# EAGLE board KELU1-0232 (EAGLE 9.0.0)
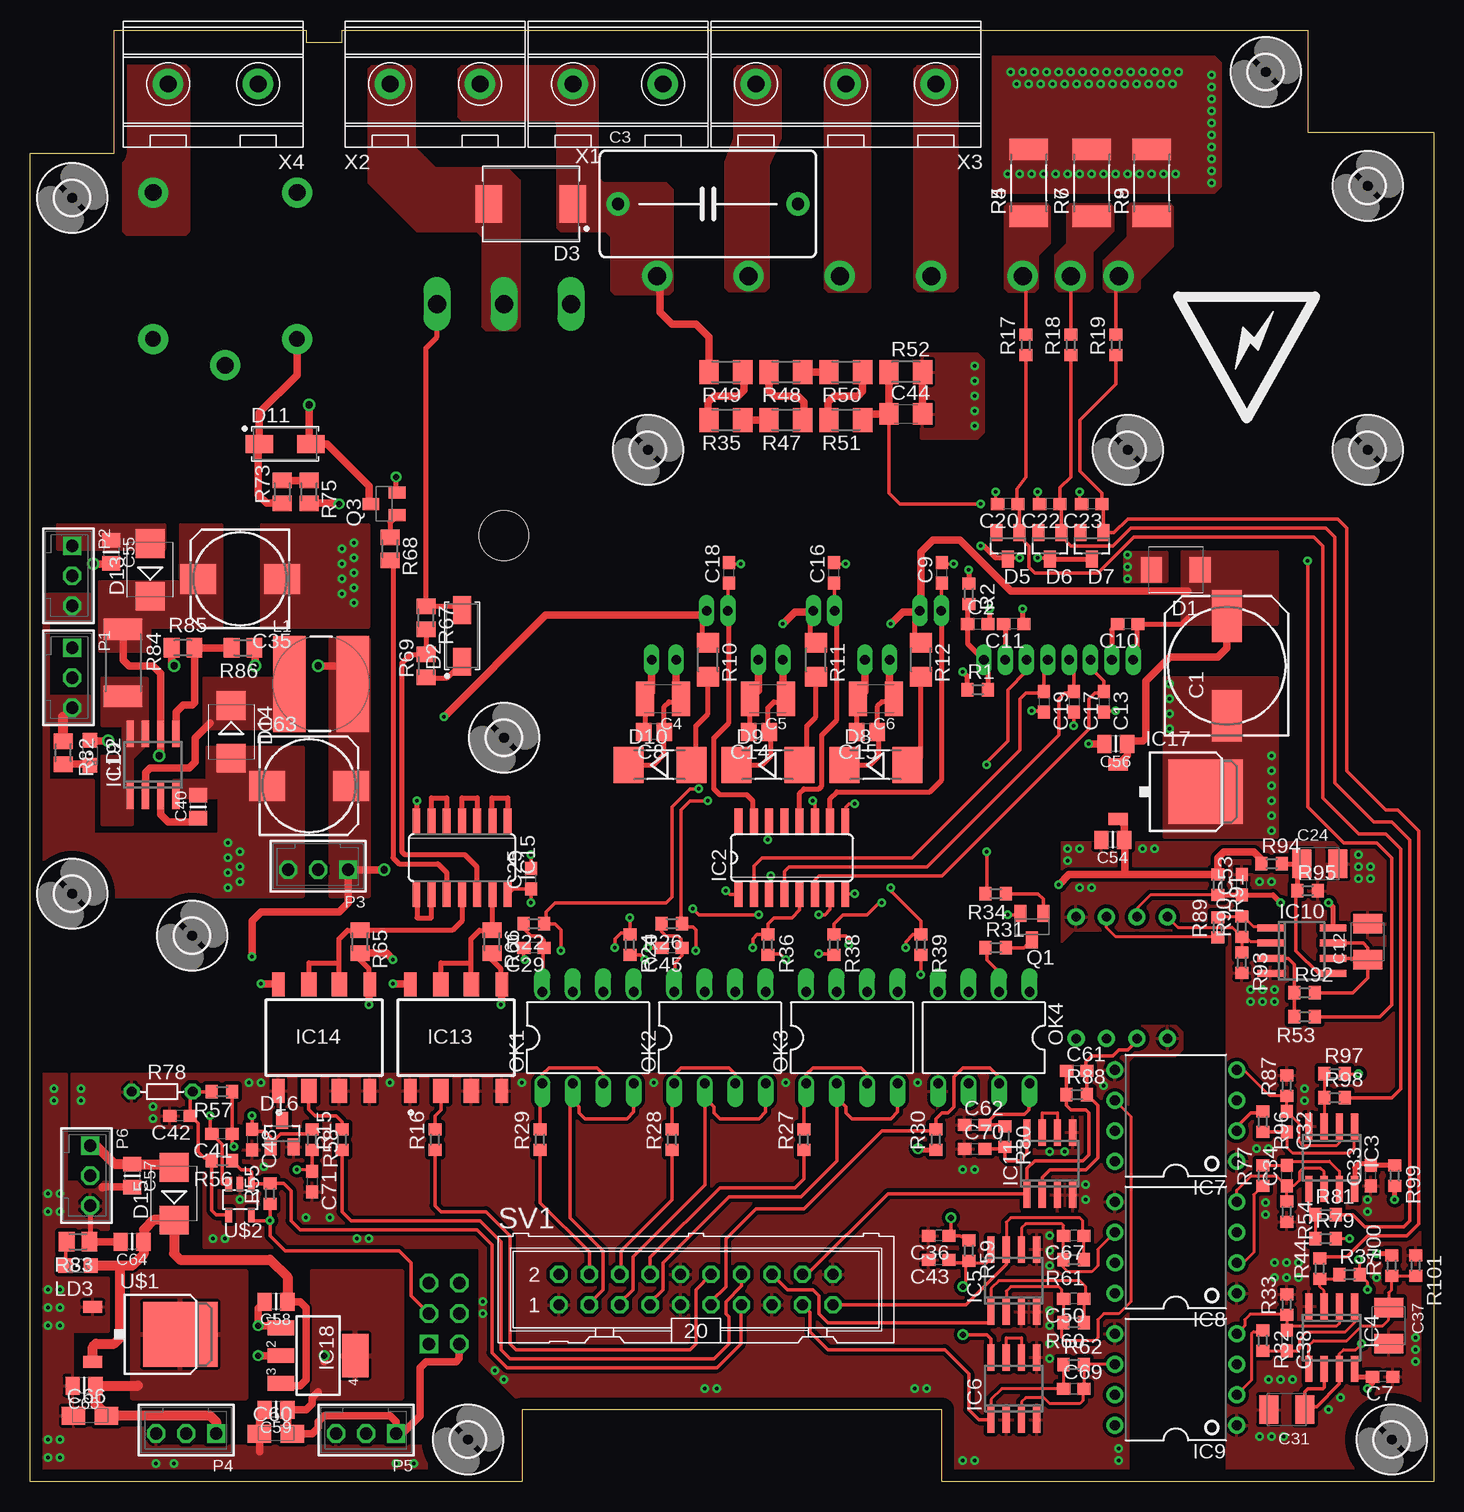
[diagram p7: board, top side]
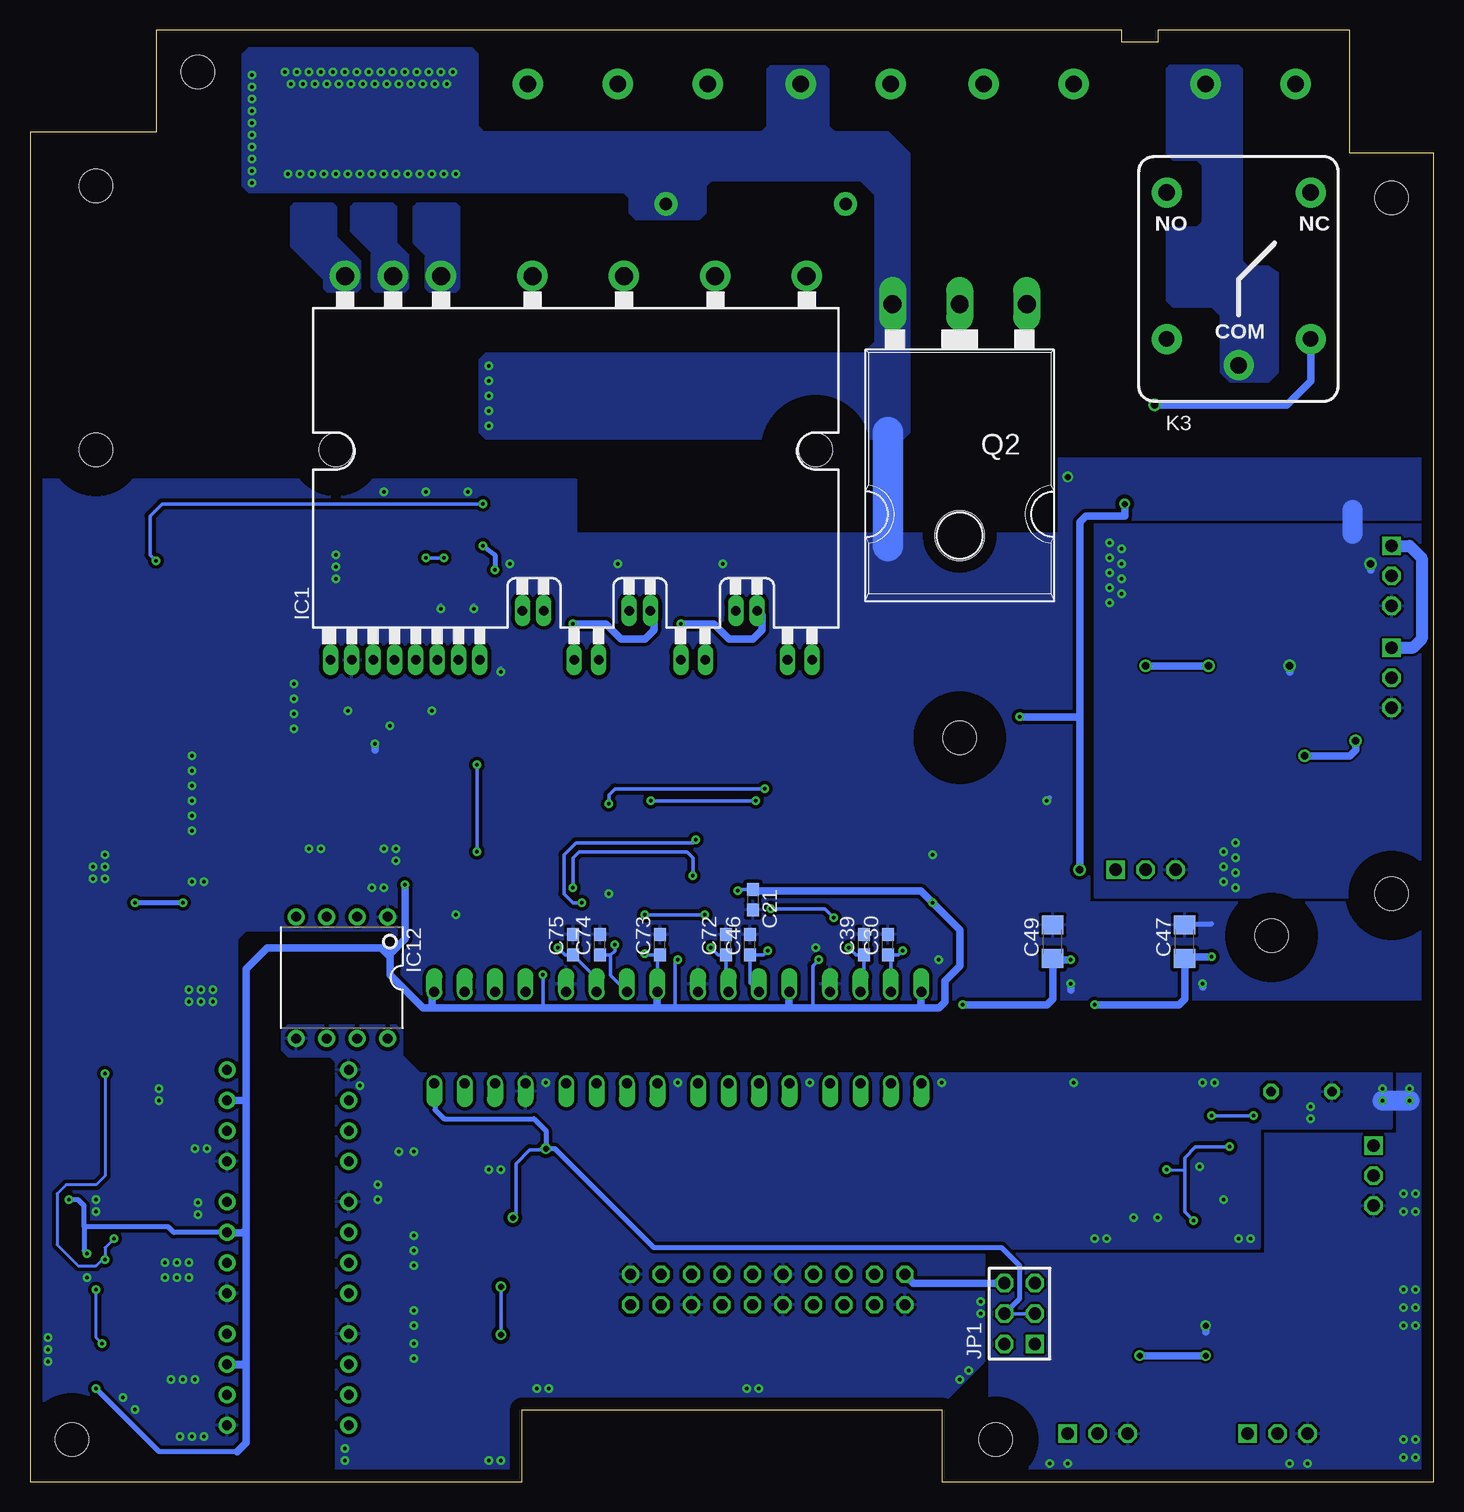
[diagram p8: board, bottom side, seen from below]

Size 117 x 121 mm. Coordinates in mm from the lower left corner, seen from the top.
Outline: 0,0 0,110.75 7,110.75 7,121 23,121 23,120 26,120 26,121 106.5,121 106.5,112.5 117,112.5 117,0 76,0 76,6 41,6 41,0 0,0
Copper layers (1*16): Top 0.035mm / dielectric 1.5mm / Bottom 0.035mm
Design rules "default": minimum track width 10mil, minimum drill 24mil, track to track 8mil, track to pad 8mil, pad to pad 8mil, via to via 8mil, smd to smd 8mil, copper to edge 40mil, drill to drill 8mil, minimum pad ring 10mil, minimum via ring 8mil, stop-mask expansion 4mil, vias tented up to drill 0mil, thermal gap 10mil

## Footprints (pad centres in the part's own frame; a part is rotated, then mirrored left to right if it is on the bottom)
140CLH-1010 = smd 4.3 x 2.5: + 4.15,0; - -4.15,0
C0603 = smd 1.1 x 1: 1 -0.85,0; 2 0.85,0
C150-091X182 = drill 1.016 pad 1.93: 1 -7.493,0; 2 7.493,0
C1210K = smd 1.5 x 2.9: 1 -1.5,0; 2 1.5,0
C0805 = smd 1.3 x 1.5: 1 -0.85,0; 2 0.85,0
SMC_B = smd 1.6 x 2.4: + -1.5,0; - 1.5,0
175TMP-0810 = smd 3 x 2.5: + 3.5,0; - -3.5,0
C0805' = smd 1.2 x 1.5: 1 -0.953,0; 2 0.953,0
C1206 = smd 1.6 x 1.8: 1 -1.4,0; 2 1.4,0
A/3216-18R = smd 1.95 x 1.5: + 1.375,0; - -1.375,0
SMBJ = smd 1.78 x 2.16: A 2.04,0; C -2.03,0
DIOM5326X292N = smd 2.3 x 1.5: A 2.15,0; K -2.15,0
DIOM7959X265N = smd 2.2 x 3.15: A 3.5,0; K -3.5,0
SOT23 = smd 1 x 1.4: 1 -0.95,-1.1; 2 0.95,-1.1; 3 0,1.1
MELF-MLL41 = smd 2.5 x 3: A 2.625,0; C -2.625,0
SMB = smd 2.4 x 2.4: A 2.2,0; C -2.2,0
2,8 = hole 2.8: 0,0
FSBB30CH60 = drill 0.8 pad 1.27 long: 1 -20.447,-16; 2 -18.669,-16; 3 -16.891,-16; 4 -15.113,-16; 5 -13.335,-16; 6 -11.557,-16; 7 -9.779,-16; 8 -8.001,-16; 9 -4.445,-11.9; 10 -2.667,-11.9; 11 -0.136,-16; 12 1.914,-16; 13 4.445,-11.9; 14 6.223,-11.9; 15 8.754,-16; 16 10.804,-16; 17 13.335,-11.9; 18 15.113,-11.9; 19 17.644,-16; 20 19.694,-16 | drill 1.5 pad 2.54: 21 -19.24,16; 22 -15.24,16; 23 -11.24,16; 24 -3.62,16; 25 4,16; 26 11.62,16; 27 19.24,16
SO16 = smd 0.66 x 2.032: 1 -4.445,-3.073; 2 -3.175,-3.073; 3 -1.905,-3.073; 4 -0.635,-3.073; 5 0.635,-3.073; 6 1.905,-3.073; 7 3.175,-3.073; 8 4.445,-3.073; 9 4.445,3.073; 10 3.175,3.073; 11 1.905,3.073; 12 0.635,3.073; 13 -0.635,3.073; 14 -1.905,3.073; 15 -3.175,3.073; 16 -4.445,3.073
SO08 = smd 0.6 x 2.2: 1 -1.905,-2.6; 2 -0.635,-2.6; 3 0.635,-2.6; 4 1.905,-2.6; 5 1.905,2.6; 6 0.635,2.6; 7 -0.635,2.6; 8 -1.905,2.6
DIL08-400 = drill 0.813 pad 1.422: 1 -3.81,-5.08; 2 -1.27,-5.08; 3 1.27,-5.08; 4 3.81,-5.08; 5 3.81,5.08; 6 1.27,5.08; 7 -1.27,5.08; 8 -3.81,5.08
HCPL-3180 = smd 1.016 x 2: 1 -3.81,-4.45; 4 3.81,-4.45; 5 3.81,4.45; 8 -3.81,4.45 | smd 1.27 x 2: 2 -1.27,-4.45; 3 1.27,-4.45; 6 1.27,4.45; 7 -1.27,4.45
SO14 = smd 0.66 x 2.032: 1 -3.81,-3.073; 2 -2.54,-3.073; 3 -1.27,-3.073; 4 0,-3.073; 5 1.27,-3.073; 6 2.54,-3.073; 7 3.81,-3.073; 8 3.81,3.073; 9 2.54,3.073; 10 1.27,3.073; 11 0,3.073; 12 -1.27,3.073; 13 -2.54,3.073; 14 -3.81,3.073
D-PAK_TO252AA = smd 1 x 1.6: 1 -2.28,-4.8; 3 2.28,-4.8 | smd 5.4 x 6.2: 4 0,2.5
SOT223 = smd 1.219 x 2.235: 1 -2.311,-3.099; 2 0,-3.099; 3 2.311,-3.099 | smd 3.6 x 2.2: 4 0,3.099
SOIC8 = smd 0.6 x 2.2: 1 -1.905,-2.6; 2 -0.635,-2.6; 3 0.635,-2.6; 4 1.905,-2.6; 5 1.905,2.6; 6 0.635,2.6; 7 -0.635,2.6; 8 -1.905,2.6
JACK = drill 0.89: P1 4.44,8.89; P2 3.17,6.35; P3 1.905,8.89; P4 0.635,6.35; P5 -0.635,8.89; P6 -1.905,6.35; P7 -3.17,8.89; P8 -4.44,6.35 | drill 1.02: P9 5.46,13.72; P10 2.92,13.72; P11 -2.92,13.72; P12 -5.46,13.72 | drill 1.63: S1 -7.87,3.05; S2 7.87,3.05 | hole 3.18: -5.715,0; 5.715,0
2X03 = drill 1.016 square: 1 -2.54,-1.27 | drill 1.016 octagon: 2 -2.54,1.27; 3 0,-1.27; 4 0,1.27; 5 2.54,-1.27; 6 2.54,1.27
HJR21FF = drill 1.3 pad 2.5: COIL_1 -6,-4; COIL_2 6,-4 | drill 1.4 pad 2.5: COM 0,-6.2; NC 6,8.2; NO -6,8.2
SDR0805 = smd 2.7 x 8: 1 -2.65,0; 2 2.65,0
CHIPLED_0805 = smd 1.2 x 1.2: A 0,-1.05; C 0,1.05
DIL08 = drill 0.813 offset: 1 -3.81,-3.81; 2 -1.27,-3.81; 3 1.27,-3.81; 4 3.81,-3.81; 5 3.81,3.81; 6 1.27,3.81; 7 -1.27,3.81; 8 -3.81,3.81
B3B-EH-A = drill 1.016 square: 1 -2.5,0 | drill 1.016 octagon: 2 0,0; 3 2.5,0
SOT23-BEC = smd 1 x 1.4: B -0.95,-1.1; C 0,1.1; E 0.95,-1.1
TO247BH = drill 1.499 long: D 0,-10.16; G -5.588,-10.16; S 5.588,-10.16 | hole 4.115: 0,9.144
R0603 = smd 1 x 1.1: 1 -0.85,0; 2 0.85,0
R2512 = smd 1.8 x 3.2: 1 -2.8,0; 2 2.8,0
R1206 = smd 1.6 x 1.803: 1 -1.422,0; 2 1.422,0
M1206 = smd 1.6 x 2: 1 -1.4,0; 2 1.4,0
M0805 = smd 1.3 x 1.6: 1 -0.95,0; 2 0.95,0
R-5 = drill 0.813 octagon: 1 -2.54,0; 2 2.54,0
ML20 = drill 0.914 octagon: 1 -11.43,-1.27; 2 -11.43,1.27; 3 -8.89,-1.27; 4 -8.89,1.27; 5 -6.35,-1.27; 6 -6.35,1.27; 7 -3.81,-1.27; 8 -3.81,1.27; 9 -1.27,-1.27; 10 -1.27,1.27; 11 1.27,-1.27; 12 1.27,1.27; 13 3.81,-1.27; 14 3.81,1.27; 15 6.35,-1.27; 16 6.35,1.27; 17 8.89,-1.27; 18 8.89,1.27; 19 11.43,-1.27; 20 11.43,1.27
SOT23-5 = smd 0.55 x 1.2: 1 -0.95,-1.3; 2 0,-1.3; 3 0.95,-1.3; 4 0.95,1.3; 5 -0.95,1.3
DG129-7.5-02P-14-00A = drill 1.4 pad 2.54: 1 -3.75,0; 2 3.75,0
DG129-7.5-03P-14-00A = drill 1.4 pad 2.54: 1 -7.5,0; 2 0,0; 3 7.5,0

## Placement (x,y rotation side)
C1  220uF 25v  [140CLH-1010]  99.75,68 90 top
C2  [C0603]  79,71.5 0 top
C3  [C150-091X182]  56.5,106.5 0 top
C4  10uF 50v  [C1210K]  52.75,65.25 180 top
C5  10uF 50v  [C1210K]  61.5,65.25 180 top
C6  10uF 50v  [C1210K]  70.5,65.25 180 top
C7  [C0603]  112.75,8.75 180 top
C8  0.1uF  [C0805]  52,62.5 180 top
C9  [C0603]  76,75.75 90 top
C10  [C0603]  91.5,71.5 180 top
C11  [C0603]  82,71.5 180 top
C12  [SMC_B]  111.5,45 90 top
C13  [C0603]  89.5,65 270 top
C14  0.1uF  [C0805]  60.75,62.5 180 top
C15  0.1uF  [C0805]  69.75,62.5 180 top
C16  [C0603]  67,75.75 90 top
C17  [C0603]  87,65 270 top
C18  [C0603]  58.25,75.75 90 top
C19  [C0603]  84.5,65 270 top
C20  [C0603]  81.5,81.5 180 top
C21  [C0603]  56.75,48.5 270 bottom
C22  [C0603]  85,81.5 180 top
C23  [C0603]  88.5,81.5 180 top
C24  [SMC_B]  107.5,51.5 0 top
C25  [C0603]  41.75,50.25 90 top
C29  [C0603]  42,44.5 180 top
C30  [C0603]  45.5,44.75 90 bottom
C31  [SMC_B]  104.75,6 180 top
C32  [C0603]  104.75,30 270 top
C33  [C0603]  111.75,25.5 90 top
C34  [C0603]  104.75,25.5 90 top
C35  100u  [175TMP-0810]  17.5,75.25 180 top
C36  [C0603]  75.75,20.5 180 top
C37  [SMC_B]  113.25,13 270 top
C38  [C0603]  104.75,11.75 270 top
C39  [C0603]  47.5,44.75 90 bottom
C40  720p  [C0805']  14,56.25 90 top
C41  [C0603]  16,29 180 top
C42  [C0603]  12.5,30.5 180 top
C43  [C0603]  75.75,18.5 180 top
C44  [C1206]  73,89 0 top
C45  [C0603]  53.5,44.5 180 top
C46  [C0603]  57,44.75 90 bottom
C47  0.1uF  [C1206]  20.75,45 90 bottom
C48  [C0603]  18.5,28.5 270 top
C49  0.1uF  [C1206]  31.75,45 90 bottom
C50  [C0603]  87,15.25 180 top
C53  [C0603]  101,49.75 90 top
C54  [C0805']  90.25,53.5 180 top
C55  [C0805']  6.75,77.5 270 top
C56  [C0805']  90.5,61.5 180 top
C57  [C0805']  8.5,25.5 270 top
C58  [C0805']  20.5,15 180 top
C59  [C0805']  20.5,6 180 top
C60  [A/3216-18R]  20.5,4 0 top
C61  [C0603]  87.25,34.25 0 top
C62  [C0603]  78.75,29.75 0 top
C63  [175TMP-0810]  23.25,58 0 top
C64  [C0805']  8.5,20 180 top
C65  [C0805']  4.5,8 180 top
C66  [A/3216-18R]  5,5.5 0 top
C67  [C0603]  87,20.5 180 top
C69  [C0603]  87,7.75 0 top
C70  [C0603]  78.75,27.75 0 top
C71  [C0603]  23.5,25 270 top
C72  [C0603]  59,44.75 90 bottom
C73  [C0603]  64.5,44.75 90 bottom
C74  [C0603]  69.5,44.75 90 bottom
C75  [C0603]  71.75,44.75 90 bottom
D1  [SMBJ]  95.5,76 180 top
D2  RS1J  [DIOM5326X292N]  36,70.5 90 top
D3  GS3J  [DIOM7959X265N]  41.75,106.5 180 top
D5  BAS70  [SOT23]  81.5,78 180 top
D6  BAS70  [SOT23]  85,78 180 top
D7  BAS70  [SOT23]  88.5,78 180 top
D8  [MELF-MLL41]  70.5,59.75 0 top
D9  [MELF-MLL41]  61.5,59.75 0 top
D10  [MELF-MLL41]  52.5,59.75 0 top
D11  [DIOM5326X292N]  21.25,86.5 0 top
D13  [SMB]  10,76 90 top
D14  STPS340U  [SMB]  16.75,62.5 270 top
D15  [SMB]  12,24 90 top
D16  LM4041-N  [SOT23]  21,29 0 top
H1  MOUNT-HOLE2.8  [2,8]  91.5,86 0 top
H2  MOUNT-HOLE2.8  [2,8]  51.5,86 0 top
H3  MOUNT-HOLE2.8  [2,8]  3.5,49 0 top
H4  MOUNT-HOLE2.8  [2,8]  113.5,3.5 0 top
H5  MOUNT-HOLE2.8  [2,8]  111.5,108 0 top
H6  MOUNT-HOLE2.8  [2,8]  3.5,107 0 top
H7  MOUNT-HOLE2.8  [2,8]  103,117.5 0 top
H8  MOUNT-HOLE2.8  [2,8]  111.5,86 0 top
H9  MOUNT-HOLE2.8  [2,8]  36.5,3.5 0 top
H10  MOUNT-HOLE2.8  [2,8]  13.5,45.5 0 top
H11  MOUNT-HOLE2.8  [2,8]  39.5,62 0 top
IC1  FSBB30CH60  [FSBB30CH60]  71.5,84.5 0 bottom
IC2  4049D  [SO16]  63.5,52 0 top
IC3  LM358D  [SO08]  108.5,27 180 top
IC4  LM358D  [SO08]  108.5,12 180 top
IC5  LM358D  [SO08]  82,16.75 0 top
IC6  LM358D  [SO08]  82,7.75 0 top
IC7  IL3000  [DIL08-400]  95.5,30.5 90 top
IC8  IL3000  [DIL08-400]  95.5,19.5 90 top
IC9  IL3000  [DIL08-400]  95.5,8.5 90 top
IC10  LM358D  [SO08]  106,44.25 270 top
IC11  LM358D  [SO08]  85,26.5 0 top
IC12  IL3000  [DIL08-400]  91,42 180 bottom
IC13  HCPL-3180-300E  [HCPL-3180]  35.5,37 0 top
IC14  HCPL-3180-300E  [HCPL-3180]  24.5,37 0 top
IC15  74AC14D  [SO14]  36,52 180 top
IC17  L78MXXAB  [D-PAK_TO252AA]  95.5,57.5 270 top
IC18  [SOT223]  24,10.5 270 top
IC19  MC34063AD  [SOIC8]  10.25,59.75 0 top
J1  0480251190  [JACK]  4,-36 0 top  (outside the outline)
JP1  [2X03]  34.5,14 90 bottom
K3  HJR-21FF  [HJR21FF]  16.25,99.25 0 bottom
L1  SDR0805  [SDR0805]  24.25,66.5 0 top
LD2  [CHIPLED_0805]  5,60.75 180 top
LD3  [CHIPLED_0805]  4,18 90 top
OK1  HCPL2530  [DIL08]  46.5,37 0 top
OK2  HCPL2530  [DIL08]  57.5,37 0 top
OK3  HCPL2530  [DIL08]  68.5,37 0 top
OK4  HCPL2530  [DIL08]  79.5,37 180 top
P1  B3B-EH-A  [B3B-EH-A]  3.5,67 270 top
P2  B3B-EH-A  [B3B-EH-A]  3.5,75.5 270 top
P3  B3B-EH-A  [B3B-EH-A]  24,51 180 top
P4  B3B-EH-A  [B3B-EH-A]  13,4 180 top
P5  B3B-EH-A  [B3B-EH-A]  28,4 180 top
P6  B3B-EH-A  [B3B-EH-A]  5,25.5 270 top
Q1  BC817-16LT1SMD  [SOT23-BEC]  83.5,46.25 180 top
Q2  IRFP240-H  [TO247BH]  39.5,88 180 bottom
Q3  BC817-40SMD  [SOT23-BEC]  29.5,81.5 90 top
R1  [R0603]  79,66 0 top
R2  [R0603]  78.25,74 270 top
R4  0.1R  [R2512]  83.25,108.25 90 top
R5  0.1R  [R2512]  83.25,108.25 90 top
R6  0.1R  [R2512]  88.5,108.25 90 top
R7  0.1R  [R2512]  88.5,108.25 90 top
R8  0.1R  [R2512]  93.5,108.25 90 top
R9  0.1R  [R2512]  93.5,108.25 90 top
R10  [R1206]  56.5,68.5 270 top
R11  [R1206]  65.5,68.5 270 top
R12  [R1206]  74.25,68.5 270 top
R15  [R0603]  26,28.5 90 top
R16  [R0603]  33.75,28.5 90 top
R17  [R0603]  83,94.75 90 top
R18  [R0603]  86.75,94.75 90 top
R19  [R0603]  90.5,94.75 90 top
R22  [R0603]  42,46.5 180 top
R24  [R0603]  50,44.75 270 top
R26  [R0603]  53.5,46.5 180 top
R27  [R0603]  64.5,28.5 90 top
R28  [R0603]  53.5,28.5 90 top
R29  [R0603]  42.5,28.5 90 top
R30  [R0603]  75.5,28.5 90 top
R31  [R0603]  80.5,44.5 0 top
R32  [R0603]  102.75,11.75 270 top
R33  [R0603]  104.75,14.75 90 top
R34  [R0603]  80.5,49 180 top
R35  1M  [M1206]  58,88.5 180 top
R36  [R0603]  61.5,44.75 270 top
R37  [R0603]  110,17.25 0 top
R38  [R0603]  67,44.75 270 top
R39  [R0603]  74.25,44.75 270 top
R44  [R0603]  107.5,17.75 90 top
R47  1M  [M1206]  63,88.5 180 top
R48  1M  [M1206]  63,92.5 180 top
R49  1M  [M1206]  58,92.5 180 top
R50  1M  [M1206]  68,92.5 180 top
R51  1M  [M1206]  68,88.5 180 top
R52  3k  [M1206]  73,92.5 0 top
R53  [R0603]  106.25,38.75 180 top
R54  [R0603]  104.75,22.5 270 top
R55  [R0603]  20,24 90 top
R56  [R0603]  16,26.75 180 top
R57  [R0603]  16,32.5 180 top
R58  [R0603]  23.5,28.5 270 top
R59  [R0603]  78.25,19.25 270 top
R60  [R0603]  87,13.25 180 top
R61  [R0603]  87,18.5 180 top
R62  [R0603]  87,9.75 0 top
R65  1k  [M0805]  27.5,45 270 top
R66  1k  [M0805]  38.5,45 270 top
R67  [M0805]  33,72 270 top
R68  [M0805]  30,77.75 270 top
R69  [M0805]  33,68 90 top
R73  [M0805]  21,82.5 90 top
R75  [M0805]  23.25,82.5 270 top
R77  [R0603]  102.75,25.5 90 top
R78  THERMISTOR-5  [R-5]  11,32.5 0 top
R79  [R0603]  108,20.25 0 top
R80  [R0603]  81.25,28.75 270 top
R81  [R0603]  108,22.25 0 top
R82  [M0805]  2.75,60.75 270 top
R83  [M0805]  4,20 180 top
R84  0.2  [R2512]  7.75,68.25 270 top
R85  1.2k  [M0805]  12.75,69.5 0 top
R86  13.2k  [M0805]  17.75,69.5 180 top
R87  [R0603]  104.75,33 90 top
R88  [R0603]  87.25,32.25 0 top
R89  [R0603]  99,46.19 90 top
R90  [R0603]  101,46.25 90 top
R91  [R0603]  99,49.75 270 top
R92  [R0603]  106.25,40.75 0 top
R93  [R0603]  101,43.25 270 top
R94  [R0603]  103.5,51.5 0 top
R95  [R0603]  106.5,49.25 0 top
R96  [R0603]  102.75,30 270 top
R97  [R0603]  108.75,34 0 top
R98  [R0603]  108.75,32 0 top
R99  [R0603]  113.75,25.5 270 top
R100  [R0603]  113.5,18 90 top
R101  [R0603]  115.5,18 270 top
SV1  [ML20]  55.5,16 0 top
U$1  MC33269DPAK  [D-PAK_TO252AA]  10.02,12.27 270 top
U$2  TS391  [SOT23-5]  17.5,23.5 180 top
U$3  [ICON_BOLT-L]  101.41,94.33 180 top
X1  DG129-7.5-02P  [DG129-7.5-02P-14-00A]  49,116.5 180 top
X2  DG129-7.5-02P  [DG129-7.5-02P-14-00A]  33.75,116.5 180 top
X3  DG129-7.5-03P  [DG129-7.5-03P-14-00A]  68,116.5 180 top
X4  DG129-7.5-02P  [DG129-7.5-02P-14-00A]  15.25,116.5 180 top

## Tracks (layer width: path | path; a pad name or v marks a point on that pad's centre or on a via)
1V65  (via drill 0.3)
  Top 0.254: IC4.7 109.14,10.63 109.5,11 110.5,11 v111,11.5 | v111.5,16 111.5,16.6 R37.2 110.85,18.4 v110.75,18.5 | v110,20.25 R79.2 | R97.2 v110.75,34
  Top 0.305: IC4.7 109.14,8.13 107.25,6.25 106.5,6.25 C31.+ 106.25,7.5 106.5,7.75 107.75,7.75 107.86,7.87 IC4.6
  Bottom 0.254: v110.75,34 110.75,25.5 111.5,24.75 114,24.75 114.75,24 114.75,19.75 113,18 111.5,18 111,18.5 v110.75,18.5 110.75,19.5 v110,20.25 | v111,11.5 111.5,12 v111.5,16
3.3V  (via drill 0.5)
  Top 0.254: R59.2 78.4,18.25 79.75,18.25 80,18.5 80,19.25 IC5.8 | v77.75,16.25 78,16.5 78,18.15 78.1,18.25
  Top 0.305: R59.2 78.1,18.25 76.6,18.25 C43.1 | IC6.8 80.09,11.9 79.75,12.25 v77.75,12.25
  Bottom 0.305: v77.75,12.25 v77.75,16.25
5VA
  Top 0.406: R99.1 C33.2 111.85,26.5 110.75,26.5 110.41,26.16 IC3.8
+3V3D  (via drill 0.5)
  Top 0.61: IC18.2 v19,10.5 | v24.5,10.5 24.5,10 | 24,7.5 23.5,7 23.5,6.5 23,6 C59.1 21.45,4.42 C60.+ 23.5,4 24,4.5 24,5 24.5,5.5 30,5.5 30.5,5 P5.1 31,4 32.5,5.5 32.5,9.5 33,10 35.5,10 35.77,10.27 JP1.2
  Bottom 0.61: v19,10.5 v24.5,10.5
  pour Top: 23.5,17.5 23.5,7 31,7 31,17.5
+5V
  Top 0.813: 9,8 C65.1 5.45,6.42 C66.+ 15,5.5 15.5,5 P4.1
  pour Top: 8.5,17.5 8.5,7 18,7 18,17.5
+5VA  (via drill 0.3)
  Top 0.152: OK1.8 42.69,41.31 42.75,41.37
  Top 0.305: 110.5,8.75 110.41,8.75 IC4.8 | R24.2 50.85,43.9 v51.25,43.5 | 42.75,41.37 42.75,44.4 C29.1 42.85,45.15 42.5,45.5 41.75,45.5 41.15,46.1 R22.2 | v41.75,48.25 C25.1 40.28,49.4 IC15.14 | v58,49.25 58.32,48.93 IC2.1 | R26.2 52.65,45.85 53,45.5 54,45.5 54.25,45.25 54.25,44.6 C45.1 54.35,43.85 53.75,43.25 53.75,40.87 OK2.8 | R36.2 61.6,44 62.5,44 v63,43.5 | R38.2 66.9,44 v65.75,44 | R39.2 74,43.65 74.25,43.65 v74.25,42.25
  Top 0.406: R100.2 113.35,19 v112.25,19 | IC4.8 110.5,9.3 110.5,8.75 C7.2 | C7.2 112,8.75 | v111.5,7.75 111.9,8.15 C7.2 | v113.75,23.5 R99.2
  Top 0.61: IC17.3 91.2,54.72 C54.1 91.25,53.45 91.25,50.6 | 91.25,50.6 86.6,50.6 v85.75,49.75 | 91.25,50.6 R91.1 99,52 99.5,52.5 102,52.5 102.65,51.85 R94.1
  Bottom 0.152: IC8.3 100.08,20.77 100.06,20.75 | OK1.8 42.75,40.81
  Bottom 0.305: v51.25,43.5 51.75,43 51.75,39.5 | C21.1 57.9,49.35 v58,49.25 | OK3.8 64.69,43.46 C73.1 65.65,43.9 v65.75,44 | v63,43.5 63.25,43.25 63.25,39.5 | v74.25,42.25 74.25,39.5
  Bottom 0.406: 112.5,21.25 105.5,21.25 105.02,20.77 IC8.3 | 99.75,2.5 106.25,2.5 v111.5,7.75 | OK1.8 42.75,40.87 | 112.5,21.25 112.5,23 113,23.5 v113.75,23.5 | 112.5,21.25 112.5,19.25 v112.25,19
  Bottom 0.61: 99,9.75 99.27,9.77 IC9.3 100.56,9.75 99,9.75 | 99,9.75 99,3.25 99.75,2.5 | 99,9.75 99,20.75 | 99,20.75 99.27,20.77 | 100.06,20.75 99,20.75 | 99,20.75 99,31.75 | 99,31.75 99.27,31.77 IC7.3 | 87.12,43.88 87,43.75 87,42.25 84.25,39.5 83.5,39.5 | 87.12,43.88 87.75,44.5 97.25,44.5 99,42.75 99,31.75 | v85.75,49.75 85.75,45.25 87.12,43.88 | OK3.8 64.75,40.81 64.75,39.5 | 64.75,39.5 74.25,39.5 83.5,39.5 | OK4.1 83.5,40.81 83.5,39.5 | OK2.8 53.75,40.81 53.75,39.5 | 53.75,39.5 63.25,39.5 64.75,39.5 | 42.75,40.81 42.75,39.5 | 42.75,39.5 51.75,39.5 53.75,39.5 | 42.75,39.5 41.25,39.5 40.75,40 40.75,41.75 39.5,43 39.5,46 v41.75,48.25 42.75,49.25 56.65,49.25 C21.1
+9V
  Top 0.813: P6.1 5.5,28 7,26.5 8.45,26.5 C57.1 11.75,26.45 D15.A
+15V  (via drill 0.3, 0.5, 0.6)
  Top 0.406: IC1.14 65,72.32 65,70.25 65.33,69.92 R11.1 | IC1.18 56,72.21 56,70.25 56.33,69.92 R10.1 | R12.1 73.75,69.92 73.75,72.18 IC1.10 | IC1.1 92.25,68.8 92.25,71.4 C10.1 96,71.5 96.5,72 | IC13.5 39.25,41.51 39.25,42.75 38.5,43.5 R66.2 | IC14.5 28.25,41.51 28.25,42.75 27.5,43.5 R65.2
  Top 0.61: R86.1 18.75,69.45 v18.75,68 | v24,68 26.75,68 | v29.5,51 P3.1 26.5,48.25 25.75,47.5 19.25,47.5 18.5,46.75 v18.5,43.75 | v25.75,81.5 25.7,81.55 R75.2 | 74,72.5 74.07,72.5 IC1.10 | 74,72.5 72.75,72.5 v71.75,71.5 | v62.75,71.5 63.75,72.5 65.25,72.5 65.25,72.57 IC1.14 | R12.1 74,70.17 | 74,72.5 74.25,72.75 74.25,77.5 75.25,78.5 77.5,78.5 81.75,74.25 96.5,74.25 | IC17.1 91.45,60.53 C56.1 91.7,61.75 92.75,61.75 93,62 93,66.75 95,68.75 99,68.75 99.75,69.5 C1.+ | 56,72.21 42.96,72.21 v34.5,63.75 | v28.25,39.75 28.25,41.39 IC14.5 | v30.25,43.5 29.7,44.05 R65.2 | v39.25,39.75 39.31,39.81 IC13.5
  Bottom 0.61: v18.75,68 v24,68 | v29.5,51 29.5,63.75 | 29.5,63.75 29.5,80 29,80.5 25.75,80.5 v25.75,81.5 | 65,72.32 65,71 65.75,70.25 67.75,70.25 69,71.5 v71.75,71.5 | 65,72.32 IC1.14 | v62.75,71.5 60,71.5 58.75,70.25 56.75,70.25 56,71 56,72.21 IC1.18 | 65,72.32 65,72.5 | v34.5,63.75 29.5,63.75 | v28.25,39.75 21.25,39.75 20.75,40.25 C47.1 20.6,43.75 v18.5,43.75 | v30.25,43.5 31.65,43.5 C49.1 31.75,40.25 32.25,39.75 v39.25,39.75
  pour Top (no thermals): 25,70.25 28.25,70.25 28.25,48.75 25,48.75
  pour Top (no thermals): 96,77.5 96,71.5 104,71.5 104,77.5
+24V
  Bottom 1.016: P2.1 2,78 1,77 1,70.25 1.75,69.5 P1.1
  pour Top (no thermals): 2.25,79.75 2.25,77.75 11.25,77.75 11.25,79.75
AGND  (via drill 0.3, 0.5, 0.6)
  Top 0.254: C22.2 84,81.65 v84,82.5 | C23.2 87.5,81.65 v87.5,82.5 | C20.2 80.5,81.65 v80.5,82.5
  Top 0.305: C9.2 76.1,76.5 v77,76.5 | C16.2 67.35,76.5 v68,76.5 | C18.2 58.6,76.5 v59.25,76.5 | C13.2 89.6,64.25 v90.5,64.25 | C17.2 v87,63 | C19.2 84.4,64.25 v83.5,64.25 | Q1.E 82.45,47.25 v81.5,47.25 | C44.2 74.5,88.9 | C29.2 41.15,43.6 v41.25,43.5 | C25.2 v41.75,52.25 | C45.2 v51.5,44.5 | IC2.8 68.02,49 v68.75,49
  Top 0.406: Q3.E 30.5,82.55 v30.5,83.75 | C2.2 80,71.65 v80,72.75 | C11.1 82.75,71.6 v82.75,72.75 | R1.1 78.15,67.1 v77.75,67.5 | C10.2 90.17,71.02 IC1.2 | IC15.7 32.25,55.13 v32.25,56.75
  Top 0.61: C55.2 6.7,76.5 v5.25,76.5 | R85.1 11.8,68.2 v12,68 | C56.2 v88.25,61.5 | IC13.8 31.64,41.5 v30.25,41.5 | IC14.8 20.64,41.5 v19.25,41.5 | C44.2 R52.2 | 74.5,88.9 74.6,89
  Top 0.813: R82.1 2.75,63.75
  Bottom 0.254: v84,82.5 83.75,82.5 | v87.5,82.5 87.25,82.5 | v80.5,82.5 80.25,82.5
  Bottom 0.305: v77,76.5 77,76.75 | v68,76.5 68,76.75 | v59.25,76.5 59.25,76.75 | v90.5,64.25 90.5,64.5 | v87,63 86.75,63 | v83.5,64.25 83.5,64 | v81.5,47.25 81.5,47 | v41.25,43.5 41.5,43.5 | v41.75,52.25 41.5,52.25 | v68.75,49 68.75,49.25
  Bottom 0.406: v30.5,83.75 30.25,83.75 | v80,72.75 80,73 | v82.75,72.75 82.75,73 | v77.75,67.5 77.75,67.75 | v32.25,56.75 32,57 | C47.2 20.65,46.5 18.5,46.5
  Bottom 0.61: v5.25,76.5 5.25,76 | v12,68 12,67.5 | v88.25,61.5 88.25,61 | v30.25,41.5 30.25,41 | v19.25,41.5 19.25,41.25
  Bottom 1.676: 6.75,79 6.75,81
  Bottom 2.54: 45.5,87.5 45.5,78
  other vias: 81.75,117.5 82.75,117.5 83.75,117.5 84.75,117.5 85.75,117.5 86.75,117.5 87.75,117.5 88.75,117.5 89.75,117.5 90.75,117.5 91.75,117.5 92.75,117.5 93.75,117.5 94.75,117.5 95.75,117.5 82.25,116.5 83.25,116.5 84.25,116.5 85.25,116.5 86.25,116.5 87.25,116.5 88.25,116.5 89.25,116.5 90.25,116.5 91.25,116.5 92.25,116.5 93.25,116.5 94.25,116.5 95.25,116.5 81.5,109 82.5,109 83.5,109 84.5,109 85.5,109 86.5,109 87.5,109 88.5,109 89.5,109 90.5,109 91.5,109 92.5,109 93.5,109 94.5,109 95.5,109 27,77 27,75.75 27,74.5 27,73.25 27,78.25 26,77.75 26,76.5 26,75.25 26,74 16.5,49.5 16.5,50.75 16.5,52 16.5,53.25 17.5,50 17.5,51.25 17.5,52.5 98.5,115.25 98.5,114.25 98.5,113.25 98.5,112.25 98.5,111.25 98.5,110.25 98.5,109.25 98.5,108.25 91.5,77.25 91.5,76.25 91.5,75.25 103.5,60.5 103.5,54.25 103.5,55.5 103.5,56.75 103.5,58 103.5,59.25 95,66.5 95,65.25 95,64 95,62.75 78.75,93 78.75,88 78.75,91.75 78.75,89.25 78.75,90.5 105.75,17 104.75,17 103.75,17 105.25,8.5 104.25,8.5 103.25,8.5 115.5,10 115.5,11 115.5,12 103,22.25 103,23.25 102.5,3.75 103.5,3.75 104.5,3.75 108.25,6 109.25,7 111.5,22.5 111.5,23.5 112.25,17 103.75,18.25 104.75,18.25 105.75,18.25 102.25,27.75 103.25,27.75 106.25,31.75 106.25,32.75 102.5,50 103.5,50 110.75,52.25 110.75,51.25 110.75,50.25 111.75,50.25 111.75,51.25 103.75,41 102.75,41 101.75,41 101.75,40 102.75,40 103.75,40 86.5,52.75 87.5,52.75 86.5,51.75 92.75,52.75 93.75,52.75 87.5,49.5 88.5,49.5 98.5,116.25 98.5,117.25
  pour Top (no thermals): 80.25,118.75 80.25,107.5 98.75,107.5 99.25,108 99.25,118.25 98.75,118.75
  pour Bottom: 0.5,79.75 28.25,79.75 28.25,48.75 0.5,48.75
  pour Top (no thermals): 19.25,79.75 19.25,71.25 28.25,71.25 28.25,79.75
  pour Top (no thermals): 14.75,61.25 22.75,61.25 22.75,48.75 0.5,48.75 0.5,74 5,74 5,71.75 1.5,71.75 1.5,65.5 5,65.5 5,63.25 1.5,63.25 1.5,58.5 5.25,58.5 5.25,54 15.75,54 15.75,57 12,57 12,58.5 14.75,58.5
  pour Bottom (isolate 0.305): 84.25,40.25 0.5,40.25 0.5,48.25 28.75,48.25 28.75,80.25 0.5,80.25 0.5,85.25 31.25,85.25 31.25,79 71.5,79 71.5,83.5 117.75,83.5 118,83.25 118,0.5 100,0.5 99.75,0.75 99.75,45.25 99,46 87,46 86,45 86,42
  pour Bottom (no thermals): 50.75,118 50.5,117.75 50.5,113 50,112.5 45.5,112.5 43.75,110.75 43.75,96 44,95.75 46.25,95.75 46.5,96 46.5,107.25 47.75,108.5 60.25,108.5 60.75,108 60.75,105.75 61.25,105.25 66.5,105.25 67,105.75 67,107 67.5,107.5 98.75,107.5 99.25,108 99.25,119 98.75,119.5 80.25,119.5 79.75,119 79.75,113 79.25,112.5 56,112.5 55.5,113 55.5,117.75 55.25,118
  pour Top (no thermals): 94.75,75 91.25,75 91.25,77.5 94.75,77.5
  pour Top (no thermals): 94.75,75 91.25,75 91.25,77.5 94.75,77.5
  pour Top (no thermals): 94.5,67 94.5,53.75 104,53.75 104,67
  pour Bottom (isolate 1.016): 44.25,87 43.75,87.5 43.75,96 46.5,96 46.5,95 47.5,94 79,94 79.5,93.5 79.5,87.5 79,87
  pour Top: 79.5,93.5 79,94 74.25,94 74.25,87 79,87 79.5,87.5
  pour Top (isolate 0.305): 99.75,45.25 99.75,0.75 100,0.5 116.5,0.5 116.5,53.25 86,53.25 86,45 87,46 99,46
BR_CON
  Top 0.305: R16.1 33.75,23 34.25,22.5 38,22.5 40,20.5 40,11.5 40.5,11 55,11 55.5,11.5 55.5,16 SV1.12
DGND  (via drill 0.3, 0.5)
  Top 0.406: P6.3 5,20.05 arc-90 R83.1
  Top 0.61: C58.2 19,14.45 v19,13 20.71,13 IC18.1 | 5,20.05 R83.1 C64.2 | 19.12,2.5 C60.- 19.12,6 C59.2 | C57.2 6,24.55 6,24.5
  Bottom 0.61: v19,13 19,12.5
  Bottom 1.676: v2,31.75 v4.25,31.75
  other vias: 1.5,13 1.5,3.5 1.5,2 10.5,1.5 12,1.5 32,1.5 30.5,1.5 1.5,14.5 1.5,16 2.5,16 2.5,14.5 2.5,13 2.5,3.5 2.5,2 1.5,24 1.5,22.5 2.5,24 2.5,22.5 17.5,23.5 19.5,26.25 38.75,9.25 39.5,8.5 56.25,7.75 57.25,7.75 37.75,15 37.75,14 27.25,20.25 28.25,20.25 4.25,32.75 2,32.75 18.25,33.25 19.25,33.25 30,33.25 41,33.25 52,33.25 63,33.25 77.75,26 74,33.25 10.25,31.25 10.25,30.25 15.25,20.25 16.25,20.25 74.75,7.75 73.75,7.75 77.75,1.75 78.75,1.75 90.75,2.75 90.75,1.75 89.5,33 86.25,27.5 85,27.5 88,24.75 88,23.5 85,14.25 85,10.25 85,11.5 85,13 85,20.5 85,19.25 85,18 23,22 25,22 78.75,26
  pour Bottom (isolate 0.305): 3.5,34 84.5,34 86,35.5 86,37.5 86.5,38 95.5,38 96,37.5 96,36 95.5,35.5 92,35.5 91.5,35 91.5,0.5 76.5,0.5 76.5,6.5 41,6.5 37.5,10 37.5,19.5 14.5,19.5 14.5,29.5 3.5,29.5
  pour Top (isolate 0.305): 0.5,0.5 0.5,34 3,34 3,25 6.5,25 6.5,21 3,21 3,17 6.5,17 6.5,12.5 3.5,12.5 3.5,4.5 11,4.5 11,3 33,3 33,0.5
  pour Top (isolate 0.305): 3.5,34 84.5,34 86,35.5 86,37.5 86.5,38 95.5,38 96,37.5 96,36 95.5,35.5 92,35.5 91.5,35 91.5,0.5 76.5,0.5 76.5,6.5 41,6.5 37.5,10 37.5,19.5 14.5,19.5 14.5,29.5 3.5,29.5
  pour Bottom: 3,34 -0.5,34 -0.5,18 -0.5,-0.5 37,-0.5 37,10.5 37,19 14,19 14,29 3,29
EXT_VCC
  Bottom 0.61: JP1.6 43.34,16.54 SV1.2
FLT
  Top 0.305: SV1.11 56.77,15.02 58,16.25 58,20.25 60.5,22.75 64.5,22.75 71,29.25 75.4,29.25 R30.2 75.5,30.25 76,30.75 76.5,30.75 77,31.25 77,33.75 77.75,34.5 80,34.5 80.77,33.73 OK4.7
I_U
  Top 0.305: R19.1 90.5,91.5 87.5,88.5 87.5,84.25 89.35,82.4 C23.1 89.45,81.5 D7.1 90.35,79.1 91.5,80.25 109,80.25 109.75,79.5 109.75,59.25 113,56 114,56 115.75,54.25 115.75,21.5 114.75,20.5 111.5,20.5 109.75,18.75 107.65,18.75 R44.2
I_U_OUT
  Top 0.254: R62.1 C69.1 81,7.75 80.09,6.84 IC6.1
  Top 0.305: SV1.17 65,14.12 65,12.5 66.5,11 76.25,11 78.25,9 78.25,6 79.1,5.15 IC6.1
I_V
  Top 0.305: R18.1 86.75,83.75 85.85,82.85 C22.1 85.95,81.5 D6.1 | D6.1 86.25,78.8 | R81.2 110.25,22.25 111.25,21.25 114.5,21.25 115,21.75 115,53.5 113.5,55 112,55 108.75,58.25 108.75,78.75 108,79.5 91.75,79.5 90.25,78 86.75,78 85.95,78.8 D6.1
I_V_OUT
  Top 0.152: SV1.19 66.95,14.75
  Top 0.254: IC5.7 81.36,21.61 81.75,22 87.5,22 87.75,21.75 87.75,20.6 C67.1 R61.1
  Top 0.305: 66.95,14.75 78,14.75 81.36,18.11 IC5.7
I_W
  Top 0.305: 82.25,81.6 C20.1 | R17.1 83,83.75 82.25,82.75 82.25,81.6 | 82.25,81.6 arc90 C20.1 | C20.1 82.45,81.5 D5.1 82.45,78.8 83.25,78 83.25,76.25 83.75,75.75 89,75.75 92,78.75 107,78.75 107.75,78 107.75,57 110.75,54 113,54 114.25,52.75 114.25,32.75 113.5,32 R98.2
I_W_OUT
  Top 0.254: R60.1 C50.1 88,15.4 88,16.25 87.5,16.75 80.75,16.75 80.09,16.09 IC5.1 80.09,13.4 80.25,13.25
  Top 0.305: SV1.16 63.12,16 65.25,16 65.75,15.5 65.75,14 66.5,13.25 79.94,13.25 arc90 80.09,13.4
INUH
  Top 0.305: C9.1 75.94,74.84 IC1.9
  Top 0.406: IC2.10 66.67,56.92 67.25,57.5 75,57.5 76,58.5 76,72.55 IC1.9
INUL
  Top 0.305: IC1.3 88.75,68.14 88.75,67.5 89.5,66.75 C13.1 89.4,65.75 88.75,65.75 88.25,65.25 88.25,62.75 76,50.5 65.75,50.5 65.41,50.16 IC2.6
INVH
  Top 0.305: C16.1 67.06,74.84 IC1.13
  Top 0.406: IC2.12 64.14,57.38 64.5,57.75 65.75,57.75 66,58 66,62.25 67.25,63.5 67.25,72.41 IC1.13
INVL
  Top 0.305: IC1.4 87,68.11 C17.1 86.9,65.75 86.25,65.75 85.75,65.25 85.75,62.25 74.75,51.25 63.25,51.25 62.87,50.87 IC2.4
INWH
  Top 0.305: C18.1 58.16,74.81 IC1.17
  Top 0.406: IC2.15 60.25,55.15 60.25,56.75 59.75,57.25 57.5,57.25 57,57.75 57,62 58.25,63.25 58.25,72.52 IC1.17
INWL
  Top 0.305: IC1.5 84.5,68.17 C19.1 84.4,65.75 83,65.75 82.5,65.25 82.5,61 73.5,52 61,52 60.33,51.33 IC2.2
N$1
  Top 0.406: D8.A 74.25,60.38 R12.2
N$2
  Top 0.406: D9.A 64.75,60.38 64.75,63 65.5,63.75 R11.2
N$3
  Top 0.406: C11.2 81.28,71.37 IC1.7
N$4
  Top 0.406: D10.A 55.25,60.38 55.5,60.62 55.5,63 56.5,64 R10.2
N$5
  Top 0.406: C4.1 54,65 53.25,65 52.85,64.6 C8.1 52.85,60.6 52,59.75 D10.C
  Top 0.61: C4.1 53.86,65.64 IC1.19
N$6
  Top 0.406: C5.1 arc-90 62.75,65 62,65 61.5,64.5 61.5,62.6 C14.1 61.6,61.9 61.75,61.75 61.75,60.5 61,59.75 D9.C
  Top 0.61: C5.1 62.75,65.5 IC1.15
N$7
  Top 0.406: C6.1 71.75,65 71,65 70.6,64.6 C15.1 70.75,62.5 70.75,60.5 70,59.75 D8.C
  Top 0.61: C6.1 71.64,65.61 IC1.11
N$8
  Top 0.406: C14.2 60,62.6 C5.2
  Top 0.61: C5.2 60.7,65.95 IC1.16
N$9
  Top 0.406: C6.2 68.9,65.15 C15.2
  Top 0.61: C6.2 69.59,65.84 IC1.12
N$10
  Top 0.406: C4.2 51.25,62.6 C8.2
  Top 0.61: C4.2 51.81,65.81 IC1.20
N$11
  Top 0.305: R17.2 83,100.5 IC1.23
  pour Top (no thermals): 81.25,99.5 81.5,99.25 83.75,99.25 84,99.5 84,102.25 85,103.25 85,106.25 84.75,106.5 81.5,106.5 81.25,106.25
  pour Bottom (no thermals): 81.25,99.5 81.25,106.25 81.5,106.5 84.75,106.5 85,106.25 85,103.25 84,102.25 84,99.5 83.75,99.25 81.5,99.25
N$12
  Top 0.305: R18.2 IC1.22
  pour Top (no thermals): 85.75,99.25 85.5,99.5 85.5,102.25 86.5,103.25 86.5,106.25 86.75,106.5 90,106.5 90.25,106.25 90.25,104.25 88.5,102.5 88.5,99.5 88.25,99.25
  pour Bottom (no thermals): 85.75,99.25 85.5,99.5 85.5,102.25 86.5,103.25 86.5,106.25 86.75,106.5 90,106.5 90.25,106.25 90.25,104.25 88.5,102.5 88.5,99.5 88.25,99.25
N$13
  Top 0.305: R19.2 90.5,100.5 IC1.21
  pour Top (no thermals): 89.75,99.25 92.25,99.25 92.5,99.5 92.5,100.25 95.25,103 95.25,106.25 95,106.5 91.75,106.5 91.5,106.25 91.5,103.75 89.5,101.75 89.5,99.5
  pour Bottom (no thermals): 89.75,99.25 89.5,99.5 89.5,101.75 91.5,103.75 91.5,106.25 91.75,106.5 95,106.5 95.25,106.25 95.25,103 92.5,100.25 92.5,99.5 92.25,99.25
N$14
  Top 0.406: R2.2 78.15,72.8 C2.1 78.15,69.85 78.5,69.5 IC1.8 79.85,68.15 R1.2
N$15  (via drill 0.3)
  Top 0.305: D5.3 81.6,77 v82.5,77 | v84,77 84.9,77 arc-90 D6.3
  Top 0.406: 81.5,76.75 D5.3 81.5,77 80.5,77 79.5,78 v79.25,78 | v78.25,76 R2.1 | D6.3 D7.3
  Bottom 0.305: v82.5,77 v84,77
  Bottom 0.406: v79.25,78 78.25,77.25 v78.25,76
N$16
  Top 0.61: R51.2 66.5,88.6 66.5,90 67,90.5 69,90.5 69.4,90.9 R50.1
N$17
  Top 0.61: R48.1 R50.2
N$18  (via drill 0.3)
  Top 0.305: v44.25,44.25 44.25,46 43.75,46.5 R22.1 43,46.65 43,47.5 43.75,48.25 53,48.25 53.5,48.75 53.5,56.25 55,57.75 v55.75,57.75 | 68.12,55.25 IC2.9 68,55.13 68,56.25 68.25,56.5 v68.75,56.5
  Bottom 0.305: OK1.7 45.23,43.63 C30.1 44.6,43.9 v44.25,44.25 | v55.75,57.75 68.25,57.75 68.75,57.25 v68.75,56.5
N$19  (via drill 0.3)
  Top 0.305: v48.75,44.5 48.75,45.25 49.25,45.75 49.85,45.75 R24.1 v50,47 | v55.25,47.75 55.75,47.25 v60.75,47.25 | v65.75,47.25 66.25,47.25 66.67,47.67 IC2.7
  Bottom 0.305: OK1.6 47.5,41.08 C39.1 48.15,43.9 v48.75,44.5 | v50,47 50.75,47.75 v55.25,47.75 | v60.75,47.25 v65.75,47.25
N$20
  Top 0.61: R47.1 64.5,88.6 64.5,90 64,90.5 62,90.5 61.6,90.9 R48.2
N$21
  Top 0.61: R35.1 R47.2
N$22
  Top 0.61: R49.1 59.5,92.4 59.5,91 59,90.5 57,90.5 56.5,90 56.5,89 56.6,88.9 R35.2
N$23
  Top 0.305: R29.2 42.5,33 OK1.1 42.69,33.94 43.25,34.5 47.25,34.5 47.75,34 47.75,33.21 OK1.3
N$24
  Top 0.305: R53.2 R92.1 105.4,43.1 104.89,43.62 IC10.3
N$25  (via drill 0.3)
  Top 0.305: v55.5,44.25 55.5,46 55.25,46.25 54.6,46.25 R26.1 54.25,46.6 54.25,56 55,56.75 v56.5,56.75 | v65.25,56.75 65.41,56.59 IC2.11
  Bottom 0.305: v56.5,56.75 v65.25,56.75 | v55.5,44.25 55.85,43.9 C46.1 57,41.58 OK2.7
N$26  (via drill 0.3)
  Top 0.305: v60.25,44.5 60.25,45.25 60.6,45.6 R36.1 61.5,46.5 62,47 63.5,47 64.14,47.63 IC2.5
  Bottom 0.305: OK2.6 59,41.04 C72.1 59.65,43.9 v60.25,44.5
N$27  (via drill 0.3)
  Top 0.305: C44.1 71.6,82.4 72.5,81.5 v79.25,81.5 | R53.1 112.5,38.75 113.5,39.75 113.5,52 112.25,53.25 109.5,53.25 106.5,56.25 v106.5,76.75
  Top 0.61: R51.1 69.9,89 C44.1 R52.1
  Bottom 0.305: v79.25,81.5 106,81.5 107,80.5 107,77.25 v106.5,76.75
N$28
  Top 0.254: C32.2 104.75,27.85 105.2,27.4 110,27.4 110.4,27.8 IC3.1
  Top 0.305: R96.2 C32.2
N$29
  Top 0.305: OK2.3 58.77,33.98 58.25,34.5 54.25,34.5 53.75,34 53.75,33.25 OK2.1 53.5,33 R28.2
N$30
  Top 0.254: R89.1 98.94,45.4 90.5,45.4 89.73,46.17 IC12.2
N$31  (via drill 0.3)
  Top 0.305: v68.25,44.75 68.25,45.25 68,45.5 67.1,45.5 R38.1 67,46.5 67.75,47.25 69.75,47.25 70.75,48.25 v71,48.25 | IC2.14 61.5,54.98 v61.5,53.5
  Bottom 0.305: v68.25,44.75 68.25,44.25 68.6,43.9 | 68.6,43.9 C74.1 | OK3.7 68.6,42.18 68.6,43.9 | v61.5,53.5 61.75,53.25 71.5,53.25 72.5,52.25 72.5,49 71.75,48.25 v71,48.25
N$32
  Top 0.254: R89.2 99.06,47.1 R90.2 101.15,47.1 102,46.25 103.31,46.25 IC10.1
N$33
  Top 0.254: IC12.4 95.69,46.2 100.2,46.2 R90.1 | IC10.2 103.28,45 101.75,45 101.35,45.4 R90.1 | R90.1 R93.1
N$34
  Top 0.305: R31.1 79.75,44.4 79.75,43.5 80.77,42.48 OK4.2
N$35  (via drill 0.3)
  Top 0.305: v73,44.5 73,45 73.6,45.6 R39.1 74.25,46.75 71.75,49.25 v71.75,49.5 | IC2.3 61.75,49.08 v61.75,50.5
  Bottom 0.305: v73,44.5 72.4,43.9 C75.1 69.77,41.92 OK3.6 | v61.75,50.5 61.75,52 62.25,52.5 71.25,52.5 71.75,52 v71.75,49.5
N$36
  Top 0.305: R16.2 33.75,30.5 34.25,31 34.25,32.53 IC13.2
N$37
  Top 0.305: R27.2 64.5,33 OK3.1 64.69,33.94 65.25,34.5 69.25,34.5 69.75,34 69.75,33.21 OK3.3
N$38
  Top 0.305: Q1.C 82.85,44.5 R31.2
N$39
  Top 0.305: R34.1 84,49 84.45,48.55 Q1.B
N$40
  Top 0.305: R96.1 102.65,30.75 101.75,30.75 100.58,29.58 IC7.2
N$41
  Top 0.254: IC3.3 107.86,31.96 R98.1 R97.1
N$42
  Top 0.254: IC4.5 106.59,11.35 107,11.75 109.75,11.75 111,13 112.75,13 113.25,13.5 C37.+ 113.25,15.75 113.5,16 R100.1 R101.2
N$43
  Top 0.305: R92.2 110.25,40.75 111.5,42 C12.+ | IC10.7 111.11,44.88 111.5,44.5 C12.+ | IC10.6 111.39,43.62 C12.+
N$44
  Top 0.254: IC5.2 81.36,15.87 81.75,16.25 85.75,16.25 86,16 86,15.4 C50.2 R60.2 86.15,12.9 86,12.75 86,12 86.25,11.75 88.75,11.75 89,12 89,13.5 89.5,14 90.75,14 91.75,15 91.75,30.44 IC7.6
N$45
  Top 0.305: IC12.6 92.27,36.77 91.5,36 90.75,36 90.25,35.5 88.5,35.5 88,35 88,34.35 C61.2 R88.2 89,31.35 89,27 88,26 85,26 84.36,25.36 IC11.2
N$46  (via drill 0.3)
  Top 0.254: R91.2 93.4,48.9 92.27,47.77 IC12.3
  Top 0.406: R91.2 C53.1 103.6,48.9 v104.25,48.25 | v108.25,48.25 108.6,47.9 IC10.8
  Bottom 0.406: v104.25,48.25 v108.25,48.25
N$47
  Top 0.305: IC14.2 23.23,31.02 23.75,30.5 25.5,30.5 26,30 R15.2
N$48
  Top 0.406: 30.1,78.7 R68.1 30,79.95 Q3.B
N$49
  Top 0.305: IC11.8 83.09,27.34 82.5,26.75 81.5,26.75 81.25,27 R80.2 81.25,27.75 C70.2
N$50
  Top 0.254: IC3.2 109.14,28.23 108.9,28 106.1,28 105.8,28.3 105.8,29.8 C32.1 R87.1 103.35,32.15 101.19,34.31 IC7.4
N$51
  Top 0.305: R57.2 R78.2 13.35,32.5 C42.1 | C42.1 13.5,30.5 | U$2.4 16.5,22.25 15.5,22.25 15.15,22.6 R56.2 14.9,27 14.5,27 14,27.5 14,29.85 C42.1
N$52
  Top 0.305: R95.1 105.5,49.1 105.5,44.25 107.41,42.34 IC10.5
  Top 0.406: R94.2 C24.+ 105.65,51.15 R95.1
N$53
  Top 0.406: IC15.13 38.5,48.89 R66.1 37.45,45.95 36.75,45.25 36.75,43.25 | IC13.6 36.75,41.47 36.75,43.25 | IC13.7 34.25,41.47 34.25,43.25 36.75,43.25
N$54
  Top 0.254: R77.1 102,23.9 102,19.1 101.13,18.23 IC8.2
N$55
  Top 0.254: IC3.7 109.14,25.86 108.3,26.7 105.1,26.7 C34.2 R77.2
N$56
  Top 0.406: IC15.12 37.25,48.95 37.25,51.25 36.25,52.25 31.25,52.25 31,52.5 31,68.25 31.7,68.95 R69.2 R67.2
N$57
  Top 0.254: IC3.6 107.86,25.84 107.6,26.1 106.1,26.1 105.8,25.8 105.8,25.1 105.35,24.65 C34.1 | R54.1 C34.1 | IC8.4 100.58,24.28 101.8,25.5 103.9,25.5 C34.1
N$58
  Top 0.254: IC5.6 82.64,21.14 83,21.5 86,21.5 86.15,21.35 C67.2 R61.2 86.15,17.85 86.5,17.5 88.5,17.5 89,18 89,19.35 IC8.6
N$59
  Top 0.254: IC9.6 87.85,9.77 R62.2 C69.2 87.75,7.4 87.75,6.75 87.5,6.5 85,6.5 84.5,7 83,7 82.64,6.63 IC6.3
N$60
  Top 0.406: IC14.6 25.75,41.47 25.75,43.25 | 25.75,43.25 25.75,45.25 26.45,45.95 R65.1 35.2,45.95 36,46.75 IC15.11 | IC14.7 23.25,41.47 23.25,43.25 25.75,43.25
N$61
  Top 0.406: R68.2 30.25,76.55 30.25,52 30.75,51.5 34,51.5 34.73,50.77 IC15.10
N$62
  Top 0.254: 102.65,12.6 R32.1 102.65,12.5 102,12.5 101.8,12.3 101.8,8.45 IC9.2
N$63
  Top 0.254: IC3.5 106.59,22.8 R81.1 R79.1
N$64
  Top 0.254: IC4.1 110.41,13.26 109.6,12.45 106.4,12.45 105.8,11.85 105.8,11.05 105.6,10.85 104.8,10.85 C38.2 R32.2
N$65
  Top 0.406: D2.A 35.7,72.95 R67.1 33,94.5 33.91,95.41 Q2.G
N$66
  Top 0.254: IC6.7 81.36,12 82.64,12 IC6.6
N$67
  Top 0.406: R69.1 33.05,67 34.75,67 36,68.25 D2.K
N$68
  Top 0.254: IC4.2 109.14,13.19 108.9,12.95 105.1,12.95 | 105.1,12.95 C38.1 | 105.1,12.95 104.75,12.95 R33.1 104.7,13.95 101.7,13.95 101.25,13.5 101.25,12.98 IC9.4
N$69
  pour Bottom (no thermals): 16.25,118 22,118 22.25,117.75 22.25,110.75 21.75,110.25 19.75,110.25 19.25,109.75 19.25,105 19.75,104.5 22,104.5 22.25,104.25 22.25,98.5 21.75,98 18.5,98 17.75,97.25 17.75,92.5 17,91.75 13.75,91.75 13,92.5 13,100.75 13.75,101.25 15.5,101.25 16,101.75 16,117.75
N$70
  Top 0.254: R37.1 108.8,16.9 R44.1 107.5,16.25 107.86,15.88 IC4.3
N$71  (via drill 0.3)
  Top 0.305: U$2.3 16.5,24.75 16.45,24.8 16,24.8 16,28.1 15.15,28.95 C41.2 15,29.15 v15,30.5 | v18.5,30.5 C48.1 18.65,29.2 19.6,29.2 20.05,28.75 D16.1 20.05,28.15 20.9,29 23.5,29 R58.1
  Bottom 0.305: v18.5,30.5 v15,30.5
N$72
  pour Top (no thermals): 8,104 13,104 13.25,104.25 13.25,117.75 13,118 8,118 7.75,117.75 7.75,104.25
N$74
  pour Top (no thermals): 37.75,96.25 37.75,103.75 37.25,104.25 32.25,104.25 28.25,108.25 28.25,117.75 28.5,118 31.75,118 32,117.75 32,111.25 33.75,109.5 39.75,109.5 40.75,108.5 40.75,96.25 40.5,96 38,96
N$75
  Top 0.61: R73.1 19.7,81.55 19,82.25 19,86.4 D11.K 19.1,89.1 22.25,92.25 K3.COIL_1
N$77  (via drill 0.6)
  Top 0.61: Q3.C 28.25,81.65 28.25,83 24.75,86.5 D11.A 23.25,86.65 v23.25,89.75
  Bottom 0.61: v23.25,89.75 12.25,89.75 10.25,91.75 K3.COIL_2
N$78
  Top 0.61: R82.2 4.9,59.8 LD2.C
N$79
  Top 0.61: R73.2 R75.1
N$81
  Top 0.406: IC15.2 38.5,55.07 38.5,57 39.81,57 IC15.1
N$86
  Top 0.406: IC15.8 32.25,48.93 32.25,47 33.46,47 IC15.9
N$87
  Top 0.305: R83.2 2.95,19.9 LD3.C
N$88
  Top 0.254: IC11.7 84.36,30.75 85.64,30.75 IC11.6
  Top 0.305: 85.5,29.1 IC11.6
N$89
  Top 0.406: IC15.6 33.46,57 34.73,57 IC15.5
N$90
  pour Top (no thermals): 6,67 9.75,67 9.75,61.5 8.5,60.25 8.5,54.75 6,54.75 6,60.5 7.75,60.5 7.75,63 6,63
N$91
  Top 0.406: IC15.4 36,57 37.27,57 IC15.3
N$92
  Top 0.61: R86.2 R85.2 13.7,64.95 13.5,64.75 12.75,64.75 12.15,64.16 IC19.5
N$93
  Top 0.61: IC19.3 10.88,55.62 11.5,55 13.7,55 C40.1
N$94
  Top 0.61: C58.1 22.5,15 23,14.5 23,8.5 22.5,8 21.09,8 IC18.3
  Top 0.813: 7.5,18 8.5,18 9.45,18.95 C64.1 9.5,20.05 9.5,21 10.3,21.8 D15.C 12,19 12.5,18.5 20,18.5 21.45,17.05 C58.1 | 7.5,18 LD3.A | U$1.3 5.22,11.22 5.5,11.5 7,11.5 7.5,12 7.5,18
N$95
  Top 0.61: IC19.2 9.62,59.12 10,59.5 13.25,59.5 13.75,60 13.75,62 15,63.25
  pour Top (no thermals): 14.5,67 22.75,67 22.75,62.75 14.5,62.75
N$97  (via drill 0.6)
  Top 0.61: R84.1 7.75,68.5 8.25,68 10.25,68 10.88,67.36 IC19.6 10.88,60.5 v10.75,60.5 | v6.5,61.75 5.05,61.75 LD2.A
  Bottom 0.61: v10.75,60.5 7,60.5 6.5,61 v6.5,61.75
  pour Top (no thermals): 5.75,75 5.75,69.25 10,69.25 10,71.25 16,71.25 16,79.75 12.5,79.75 12.5,75
PWM_U_H
  Top 0.305: R29.1 42.5,23.25 46.61,19.14 SV1.4
PWM_U_L
  Top 0.305: 45,31.5 45,32.96 OK1.2 | 45,31.5 45,22 47.75,19.25 47.75,16 46.61,14.86 SV1.3 | OK1.4 50.31,30.81 49.75,30.25 46.25,30.25 45.75,30.75 45.75,31.25 45.5,31.5 45,31.5
PWM_V_H
  Top 0.305: SV1.6 49.25,17.37 49.25,19.25 53.5,23.5 R28.1
PWM_V_L
  Top 0.254: SV1.5 49.15,14.9
  Top 0.305: 49.15,14.9 50.25,16 50.25,18.75 56.25,24.75 56.25,31.5 | 56.25,31.5 56.25,33.17 OK2.2 | OK2.4 61.31,30.81 60.75,30.25 57.5,30.25 57,30.75 57,31.25 56.75,31.5 56.25,31.5
PWM_W_H
  Top 0.305: R27.1 64.5,25.25 63.75,24.5 57.5,24.5 51.69,18.69 SV1.8
PWM_W_L
  Top 0.305: 67.25,31.5 67.25,33.17 OK3.2 | 67.25,31.5 67.25,26.75 64.25,23.75 58.25,23.75 52.75,18.25 52.75,16 51.69,14.94 SV1.7 | OK3.4 72.31,30.81 71.75,30.25 68.5,30.25 68,30.75 68,31.25 67.75,31.5 67.25,31.5
RLY_FLT
  Top 0.254: 59.25,14.67 SV1.13
  Top 0.305: R56.1 17.6,26 18.25,26 18.45,25.8 U$2.1 19.95,24.8 R55.2 21.15,24.85 21.75,24.25 21.75,21.75 22.5,21 37.25,21 38.5,19.75 38.5,10.75 39.75,9.5 57.25,9.5 59.25,11.5 59.25,14.67
SFT_ST
  Top 0.305: R15.1 26,22.5 26.75,21.75 37.5,21.75 39.25,20 39.25,11 40,10.25 57,10.25 58.25,11.5 58.25,13.75 58,14 58,15 59.31,16.31 SV1.14
U_PWM
  pour Top (no thermals): 74,99.25 73.75,99.5 73.75,117.75 74,118 77,118 77.25,117.75 77.25,99.5 77,99.25
V_PWM
  pour Top (no thermals): 69.75,99.25 70,99.5 70,117.75 69.75,118 66.5,118 66.25,117.75 66.25,99.5 66.5,99.25
VCCIO  (via drill 0.3, 0.5)
  Top 0.254: 23.35,26 v22.25,26
  Top 0.305: R57.1 C41.1 16.85,28.05 v17,27.9 | R58.2 C71.1 23.35,26 | JP1.3 33.23,14.02 31.75,15.5 31.75,18.25 30.75,19.25 21.25,19.25 20,20.5 v20,21.75 | R55.1 v20,21.75 | v20,21.75 18.45,21.75 U$2.5 | OK4.8 83.25,33.19 83.25,31 82.88,30.62 80.47,30.62 C62.2 81.25,29.75 R80.1 | v76.75,22 76.75,20.9 C36.1 77.5,20.5 R59.1
  Top 0.406: v74,27.75 74.1,27.65 R30.1
  Bottom 0.254: v22.25,26 20.75,26
  Bottom 0.305: v20,21.75 20.75,22.5 20.75,26 20.75,27 19.85,27.9 v17,27.9 | JP1.3 JP1.4 | v76.75,22 76.5,22.25 76.5,26.5 75.35,27.65 74.5,27.65 74.4,27.75 v74,27.75
  Bottom 0.406: JP1.4 34.5,15.27 34.5,18 36,19.5 65,19.5 73.25,27.75 v74,27.75 74,29.25 75,30.25 82.5,30.25 83.25,31 83.25,33.13 OK4.8
VDC+
  Top 0.61: IC1.27 52.5,100.26 52.5,97.5 53.5,96.5 55.5,96.5 56.6,95.4 R49.2
  pour Top (no thermals): 47,118 47.25,117.75 47.25,108.75 47.75,108.25 53,108.25 53.5,107.75 53.5,99.25 53.25,99 48.75,99 48.5,99.25 48.5,103.75 48,104.25 44.25,104.25 44,104.5 44,113.25 43.75,113.5 36,113.5 35.75,113.75 35.75,117.75 36,118
VFO  (via drill 0.3)
  Top 0.305: R34.2 79.75,49.1 v79.75,52.5 | v79.75,59.75 79.75,60 81.5,61.75 81.5,66 83.06,67.56 IC1.6
  Bottom 0.305: v79.75,52.5 v79.75,59.75
VOLT_SENS
  Top 0.305: C61.1 R88.1 86.4,31.35 86.75,31 88,31 88.25,30.75 88.25,27.25 87.75,26.75 83.75,26.75 83.09,26.09 IC11.1 83,24 71.5,24 64.77,17.27 SV1.18
W_PWM
  pour Top (no thermals): 61.25,99.25 58.25,99.25 58,99.5 58,110 58.75,112 58.75,117.75 59,118 62.25,118 62.5,117.75 62.5,112 61.5,109.75 61.5,99.5